# Altium project Learning stand.PrjPcb (part 2 of 2)

## Sheet LEDs.SchDoc
size 420 x 297 mm; Address1: Address1; Address2: Address2; Address3: Address3; Address4: Address4; DocumentNumber: МЭИ.466219.001 Э3; SheetNumber: 2; Scale: 1:1; DocumentType: Схема электрическая принципиальная; FirstReferrence: АБВГ.123456.001
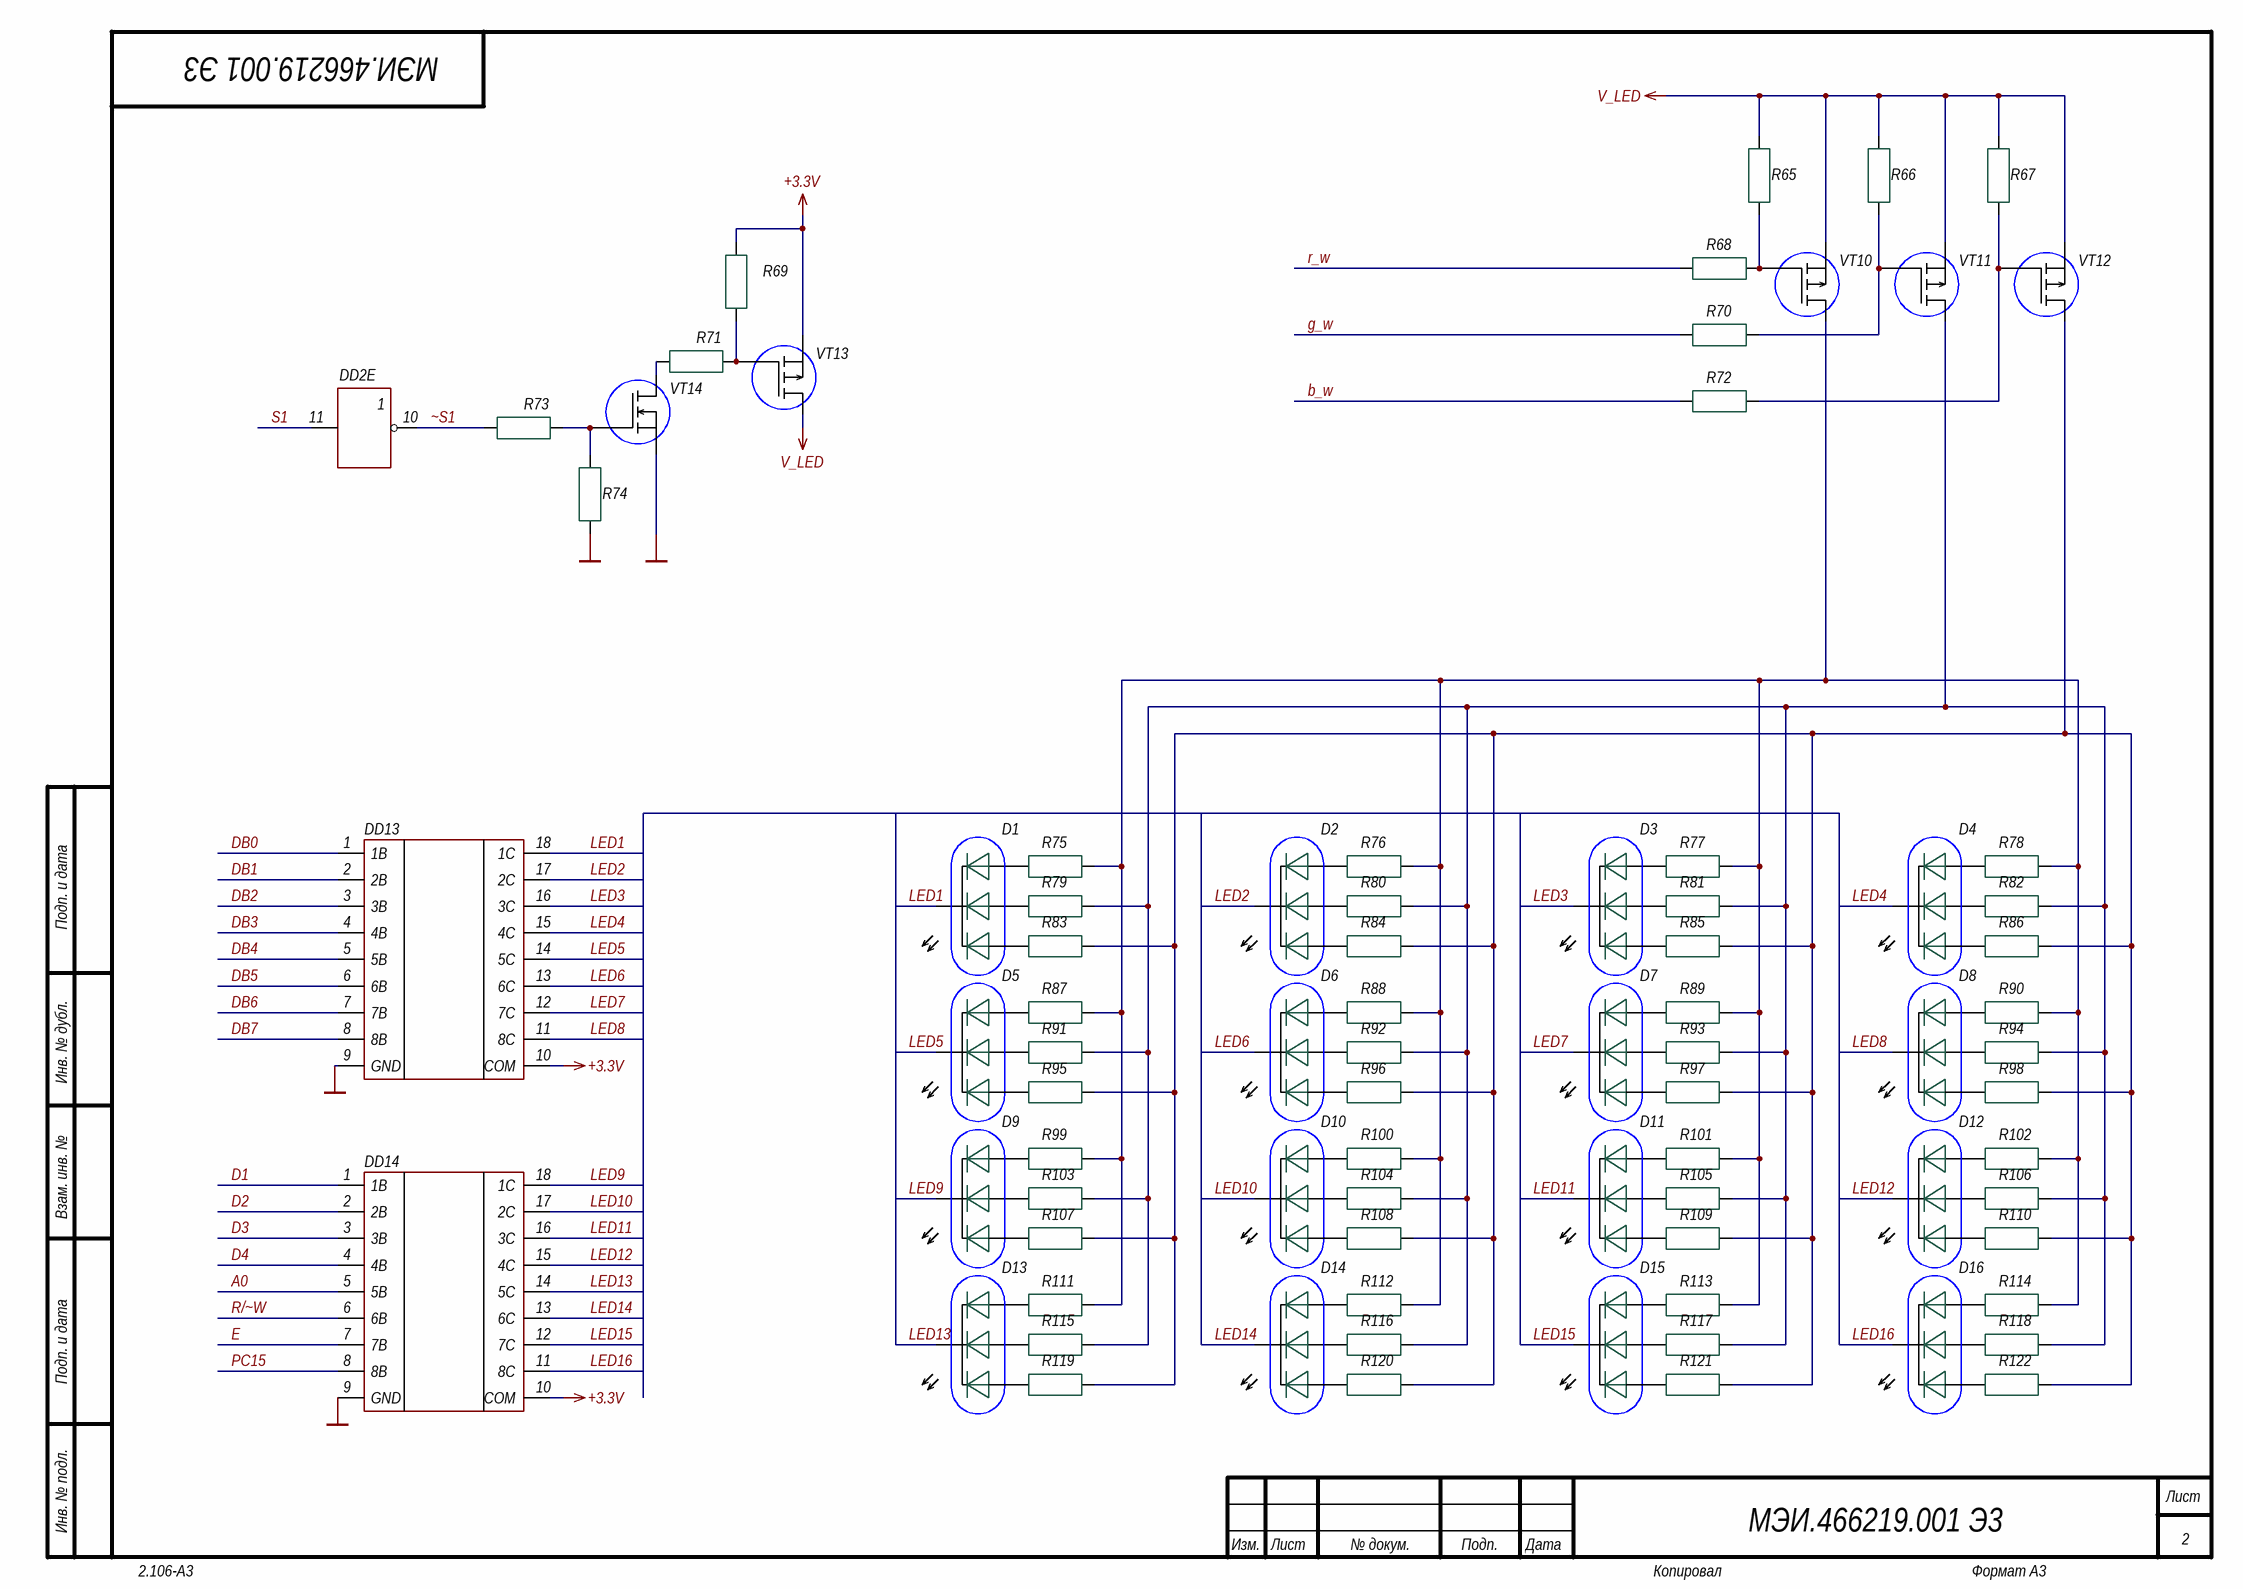
[diagram p4: LEDs.SchDoc]

### Parts
D1  FYLS-5050RGBC  [SOP6LED]  (value not drawn)
D2  FYLS-5050RGBC  [SOP6LED]  (value not drawn)
D3  FYLS-5050RGBC  [SOP6LED]  (value not drawn)
D4  FYLS-5050RGBC  [SOP6LED]  (value not drawn)
D5  FYLS-5050RGBC  [SOP6LED]  (value not drawn)
D6  FYLS-5050RGBC  [SOP6LED]  (value not drawn)
D7  FYLS-5050RGBC  [SOP6LED]  (value not drawn)
D8  FYLS-5050RGBC  [SOP6LED]  (value not drawn)
D9  FYLS-5050RGBC  [SOP6LED]  (value not drawn)
D10  FYLS-5050RGBC  [SOP6LED]  (value not drawn)
D11  FYLS-5050RGBC  [SOP6LED]  (value not drawn)
D12  FYLS-5050RGBC  [SOP6LED]  (value not drawn)
D13  FYLS-5050RGBC  [SOP6LED]  (value not drawn)
D14  FYLS-5050RGBC  [SOP6LED]  (value not drawn)
D15  FYLS-5050RGBC  [SOP6LED]  (value not drawn)
D16  FYLS-5050RGBC  [SOP6LED]  (value not drawn)
DD2  SN74AHCU04DR  [SOIC127P780X200-14N]  (value not drawn)  (part E of 7)
DD13  ULN2803ADW  [SOIC127P600-8N]  (value not drawn)
DD14  ULN2803ADW  [SOIC127P600-8N]  (value not drawn)
R65  Thick Film  [RESC1608X55N]  (value not drawn)
R66  Thick Film  [RESC1608X55N]  (value not drawn)
R67  Thick Film  [RESC1608X55N]  (value not drawn)
R68  Thick Film  [RESC1608X55N]  (value not drawn)
R69  Thick Film  [RESC1608X55N]  (value not drawn)
R70  Thick Film  [RESC1608X55N]  (value not drawn)
R71  Thick Film  [RESC1608X55N]  (value not drawn)
R72  Thick Film  [RESC1608X55N]  (value not drawn)
R73  Thick Film  [RESC1608X55N]  (value not drawn)
R74  Thick Film  [RESC1608X55N]  (value not drawn)
R75  Thick Film  [RESC1608X55N]  (value not drawn)
R76  Thick Film  [RESC1608X55N]  (value not drawn)
R77  Thick Film  [RESC1608X55N]  (value not drawn)
R78  Thick Film  [RESC1608X55N]  (value not drawn)
R79  Thick Film  [RESC1608X55N]  (value not drawn)
R80  Thick Film  [RESC1608X55N]  (value not drawn)
R81  Thick Film  [RESC1608X55N]  (value not drawn)
R82  Thick Film  [RESC1608X55N]  (value not drawn)
R83  Thick Film  [RESC1608X55N]  (value not drawn)
R84  Thick Film  [RESC1608X55N]  (value not drawn)
R85  Thick Film  [RESC1608X55N]  (value not drawn)
R86  Thick Film  [RESC1608X55N]  (value not drawn)
R87  Thick Film  [RESC1608X55N]  (value not drawn)
R88  Thick Film  [RESC1608X55N]  (value not drawn)
R89  Thick Film  [RESC1608X55N]  (value not drawn)
R90  Thick Film  [RESC1608X55N]  (value not drawn)
R91  Thick Film  [RESC1608X55N]  (value not drawn)
R92  Thick Film  [RESC1608X55N]  (value not drawn)
R93  Thick Film  [RESC1608X55N]  (value not drawn)
R94  Thick Film  [RESC1608X55N]  (value not drawn)
R95  Thick Film  [RESC1608X55N]  (value not drawn)
R96  Thick Film  [RESC1608X55N]  (value not drawn)
R97  Thick Film  [RESC1608X55N]  (value not drawn)
R98  Thick Film  [RESC1608X55N]  (value not drawn)
R99  Thick Film  [RESC1608X55N]  (value not drawn)
R100  Thick Film  [RESC1608X55N]  (value not drawn)
R101  Thick Film  [RESC1608X55N]  (value not drawn)
R102  Thick Film  [RESC1608X55N]  (value not drawn)
R103  Thick Film  [RESC1608X55N]  (value not drawn)
R104  Thick Film  [RESC1608X55N]  (value not drawn)
R105  Thick Film  [RESC1608X55N]  (value not drawn)
R106  Thick Film  [RESC1608X55N]  (value not drawn)
R107  Thick Film  [RESC1608X55N]  (value not drawn)
R108  Thick Film  [RESC1608X55N]  (value not drawn)
R109  Thick Film  [RESC1608X55N]  (value not drawn)
R110  Thick Film  [RESC1608X55N]  (value not drawn)
R111  Thick Film  [RESC1608X55N]  (value not drawn)
R112  Thick Film  [RESC1608X55N]  (value not drawn)
R113  Thick Film  [RESC1608X55N]  (value not drawn)
R114  Thick Film  [RESC1608X55N]  (value not drawn)
R115  Thick Film  [RESC1608X55N]  (value not drawn)
R116  Thick Film  [RESC1608X55N]  (value not drawn)
R117  Thick Film  [RESC1608X55N]  (value not drawn)
R118  Thick Film  [RESC1608X55N]  (value not drawn)
R119  Thick Film  [RESC1608X55N]  (value not drawn)
R120  Thick Film  [RESC1608X55N]  (value not drawn)
R121  Thick Film  [RESC1608X55N]  (value not drawn)
R122  Thick Film  [RESC1608X55N]  (value not drawn)
VT10  IRLML2244  [SOT23-3-no_check]  (value not drawn)
VT11  IRLML2244  [SOT23-3-no_check]  (value not drawn)
VT12  IRLML2244  [SOT23-3-no_check]  (value not drawn)
VT13  IRLML2244  [SOT23-3-no_check]  (value not drawn)
VT14  IRLML6244  [SOT23-3-no_check]  (value not drawn)

### Nets
+3.3V: DD13.10(COM) DD14.10(COM) R69.2 VT13.2(S)
GND: DD13.9(GND) DD14.9(GND) R74.1 VT14.2(S)
V_LED: R65.2 R66.2 R67.2 VT10.2(S) VT11.2(S) VT12.2(S) VT13.3(D)
A0: DD14.5(5B)
b_w: R72.1
D1: DD14.1(1B)
D2: DD14.2(2B)
D3: DD14.3(3B)
D4: DD14.4(4B)
DB0: DD13.1(1B)
DB1: DD13.2(2B)
DB2: DD13.3(3B)
DB3: DD13.4(4B)
DB4: DD13.5(5B)
DB5: DD13.6(6B)
DB6: DD13.7(7B)
DB7: DD13.8(8B)
E: DD14.7(7B)
g_w: R70.1
LED1: D1.K DD13.18(1C)
LED2: D2.K DD13.17(2C)
LED3: D3.K DD13.16(3C)
LED4: D4.K DD13.15(4C)
LED5: D5.K DD13.14(5C)
LED6: D6.K DD13.13(6C)
LED7: D7.K DD13.12(7C)
LED8: D8.K DD13.11(8C)
LED9: D9.K DD14.18(1C)
LED10: D10.K DD14.17(2C)
LED11: D11.K DD14.16(3C)
LED12: D12.K DD14.15(4C)
LED13: D13.K DD14.14(5C)
LED14: D14.K DD14.13(6C)
LED15: D15.K DD14.12(7C)
LED16: D16.K DD14.11(8C)
PC15: DD14.8(8B)
R/~W: DD14.6(6B)
r_w: R68.1
S1: DD2.11(5A)
~S1: DD2.10(5Y) R73.1
NetD1_AB: D1.AB R83.1
NetD1_AG: D1.AG R79.1
NetD1_AR: D1.AR R75.1
NetD2_AB: D2.AB R84.1
NetD2_AG: D2.AG R80.1
NetD2_AR: D2.AR R76.1
NetD3_AB: D3.AB R85.1
NetD3_AG: D3.AG R81.1
NetD3_AR: D3.AR R77.1
NetD4_AB: D4.AB R86.1
NetD4_AG: D4.AG R82.1
NetD4_AR: D4.AR R78.1
NetD5_AB: D5.AB R95.1
NetD5_AG: D5.AG R91.1
NetD5_AR: D5.AR R87.1
NetD6_AB: D6.AB R96.1
NetD6_AG: D6.AG R92.1
NetD6_AR: D6.AR R88.1
NetD7_AB: D7.AB R97.1
NetD7_AG: D7.AG R93.1
NetD7_AR: D7.AR R89.1
NetD8_AB: D8.AB R98.1
NetD8_AG: D8.AG R94.1
NetD8_AR: D8.AR R90.1
NetD9_AB: D9.AB R107.1
NetD9_AG: D9.AG R103.1
NetD9_AR: D9.AR R99.1
NetD10_AB: D10.AB R108.1
NetD10_AG: D10.AG R104.1
NetD10_AR: D10.AR R100.1
NetD11_AB: D11.AB R109.1
NetD11_AG: D11.AG R105.1
NetD11_AR: D11.AR R101.1
NetD12_AB: D12.AB R110.1
NetD12_AG: D12.AG R106.1
NetD12_AR: D12.AR R102.1
NetD13_AB: D13.AB R119.1
NetD13_AG: D13.AG R115.1
NetD13_AR: D13.AR R111.1
NetD14_AB: D14.AB R120.1
NetD14_AG: D14.AG R116.1
NetD14_AR: D14.AR R112.1
NetD15_AB: D15.AB R121.1
NetD15_AG: D15.AG R117.1
NetD15_AR: D15.AR R113.1
NetD16_AB: D16.AB R122.1
NetD16_AG: D16.AG R118.1
NetD16_AR: D16.AR R114.1
NetR65_1: R65.1 R68.2 VT10.1(G)
NetR66_1: R66.1 R70.2 VT11.1(G)
NetR67_1: R67.1 R72.2 VT12.1(G)
NetR69_1: R69.1 R71.2 VT13.1(G)
NetR71_1: R71.1 VT14.3(D)
NetR73_2: R73.2 R74.2 VT14.1(G)
NetR75_2: R75.2 R76.2 R77.2 R78.2 R87.2 R88.2 R89.2 R90.2 R99.2 R100.2 R101.2 R102.2 R111.2 R112.2 R113.2 R114.2 VT10.3(D)
NetR79_2: R79.2 R80.2 R81.2 R82.2 R91.2 R92.2 R93.2 R94.2 R103.2 R104.2 R105.2 R106.2 R115.2 R116.2 R117.2 R118.2 VT11.3(D)
NetR83_2: R83.2 R84.2 R85.2 R86.2 R95.2 R96.2 R97.2 R98.2 R107.2 R108.2 R109.2 R110.2 R119.2 R120.2 R121.2 R122.2 VT12.3(D)

### Notes on the sheet
- Подп. и дата
- Инв. № дубл.
- Взам. инв. №
- Инв. № подл.
- Изм.
- Лист
- № докум.
- Подп.
- Дата
- 2.106-A3
- Копировал
- Формат А3

### Library data of the parts
D1-D16 = FYLS-5050RGBC: RGB LED; Manufacture: FORYARD OPTOELECTRONICS CO.,LTD; Model: FYLS-5050RGBC; HelpURL: http://www.foryard.com/x-en/p-download/d-Part/u-f/m-1/n-f_FYLS-5050RGBC/y-394; Case: SMT package
DD2 = SN74AHCU04: HEX invertor; Manufacture: TI; HelpURL: https://www.compel.ru/infosheet/TI/SN74AHCU04D; Case: SO-14 (NS); Model: SN74AHCU04DR
DD13 DD14 = ULN2803: Darlington Assembly; Manufacture: TI; HelpURL: https://www.compel.ru/infosheet/TI/ULN2803ADWR; Case: SO-18; Model: ULN2803ADW
R65-R67 R69 R74 = RES_10K_0603_1%: Resistor SMD chip 10k Ohm 0.1W 1% 0603; Manufacturer 1: Yageo; Manufacturer Part Number 1: RC0603FR-0710KL; Ratings: 1/10W; SCDType: spec; ComponentLink1Designator: Compel; Package / Case: 0603 (1608 Metric); Supplier 1: Compel; Supplier Part Number 1: 311-10.0KHRCT-ND; Tolerance: ±1%; Value: 10K; ComponentLink1URL: https://www.compel.ru/infosheet/YAG/RC0603FR-0710KL
R68 R70-R73 = RES_470R_0603_5%: Resistor SMD chip 470 Ohm 0.1W 5% 0603; Manufacturer 1: Yageo; Manufacturer Part Number 1: CRCW0603470RJNEA; Ratings: 1/10 W; SCDType: spec; Value: 470R; ComponentLink1Designator: Compel; Package / Case: 0603 (1608 metric); Tolerance: ±5%; Material: Thick Film; Supplier 1: Compel; Supplier Part Number 1: 541-470GCT-ND; ComponentLink1URL: https://www.compel.ru/infosheet/YAG/RC0603FR-07470RL
R75-R122 = RES_1K2_0603_1%: Resistor SMD chip 1,2 kOhm 0.1W 1% 0603; Manufacturer 1: Yageo; Manufacturer Part Number 1: RC0603FR-071K2L; Ratings: 1/10 W; SCDType: spec; Value: 1,2k; ComponentLink1Designator: Compel; Package / Case: 0603 (1608 metric); Tolerance: ±1%; Material: Thick Film; Supplier 1: Compel; Supplier Part Number 1: 311-68GRCT-ND; ComponentLink1URL: https://www.compel.ru/infosheet/YAG/RC0603FR-0768RL
VT10-VT13 = MOSFET_P-CH_IRLML2244TRPbF: MOSFET P-Channel SMD; Manufacturer 1: Infineon; Ratings: 20V; 4.3A; SCDType: undef; Package / Case: SOT-23-3; Supplier 1: Compel; Supplier Part Number 1: IRLML2244TRPbF; ComponentLink1URL: https://www.compel.ru/item-pdf/b67edcdbc583bffdc43763720a97c5ae/ps/infin~irlml2246pbf.pdf; ComponentLink1Description: Data; ComponentLink2Description: Compel; ComponentLink2URL: https://www.compel.ru/infosheet/INFIN/IRLML2246TRPBF; Manufacturer Part Number 1: IRLML2244TRPbF
VT14 = MOSFET_N-CH_IRLML6244TRPBF: MOSFET N-Channel SMD; Manufacturer 1: Infineon; Ratings: 20V; 6.3A; SCDType: undef; Package / Case: SOT-23-3; Supplier 1: Compel; Supplier Part Number 1: IRLML6244TRPBF; ComponentLink1URL: https://www.compel.ru/item-pdf/c888608b045c7f9cf47a03db2a6506b1/ps/infin~irlml6244pbf.pdf; ComponentLink1Description: Data; ComponentLink2Description: Compel; ComponentLink2URL: https://www.compel.ru/infosheet/INFIN/IRLML6244TRPBF; Manufacturer Part Number 1: IRLML6244TRPBF

## Nets that join several sheets
+3.3V: Microcontroller (13 pins), Peripherals (22 pins), Communication (15 pins), Displays (6 pins), LEDs (DD13.10 DD14.10 R69.2 VT13.2)
AVCC: Microcontroller (A1.P2_19), Peripherals (DA2.1)
GND: Microcontroller (29 pins), Peripherals (34 pins), Communication (37 pins), Displays (8 pins), LEDs (DD13.9 DD14.9 R74.1 VT14.2)
A0: Microcontroller (A1.P2_13), Displays (HG1.4), LEDs (DD14.5)
ADC_IN0: Microcontroller (A1.P1_15), Communication (C24.1 R26.2 VD22.K)
ADC_IN1: Microcontroller (A1.P1_16), Communication (C26.1 R30.2 VD23.K)
b_w: Microcontroller (DD1.10), LEDs (R72.1)
C0: Microcontroller (A1.P2_10), Peripherals (R16.1)
C1: Microcontroller (A1.P2_9), Peripherals (R17.1)
C2: Microcontroller (A1.P2_8), Peripherals (R18.1)
C3: Microcontroller (A1.P2_7), Peripherals (R19.1)
CAN_RX: Microcontroller (A1.P2_4), Communication (DD12.4)
CAN_TX: Microcontroller (A1.P2_3), Communication (DD12.1)
D1: Microcontroller (A1.P2_27), Displays (DD2.1), LEDs (DD14.1)
D2: Microcontroller (A1.P2_26), Displays (DD2.3), LEDs (DD14.2)
D3: Microcontroller (A1.P2_15), Displays (DD2.5), LEDs (DD14.3)
D4: Microcontroller (A1.P2_14), Displays (DD2.9), LEDs (DD14.4)
DAC_OUT1: Microcontroller (A1.P1_21), Communication (R27.2)
DAC_OUT2: Microcontroller (A1.P1_22), Communication (R31.2)
DB0: Microcontroller (A1.P1_11), Displays (HG1.7), LEDs (DD13.1)
DB1: Microcontroller (A1.P1_12), Displays (HG1.8), LEDs (DD13.2)
DB2: Microcontroller (A1.P1_13), Displays (HG1.9), LEDs (DD13.3)
DB3: Microcontroller (A1.P1_14), Displays (HG1.10), LEDs (DD13.4)
DB4: Microcontroller (A1.P1_25), Displays (HG1.11), LEDs (DD13.5)
DB5: Microcontroller (A1.P1_26), Displays (HG1.12), LEDs (DD13.6)
DB6: Microcontroller (A1.P2_29), Displays (HG1.13), LEDs (DD13.7)
DB7: Microcontroller (A1.P2_28), Displays (HG1.14), LEDs (DD13.8)
E: Microcontroller (A1.P1_5), Displays (HG1.6), LEDs (DD14.7)
g_w: Microcontroller (DD1.4), LEDs (R70.1)
I2C_SCL: Microcontroller (A1.P1_30), Peripherals (DD6.6 DD7.2 DD8.6 R14.1)
I2C_SDA: Microcontroller (A1.P1_31), Peripherals (DD6.5 DD7.1 DD8.1 R15.1)
LCD: Microcontroller (DD3.3 R4.1), Displays (R55.1)
LED1: Displays (R57.1), LEDs (D1.K DD13.18)
LED2: Displays (R58.1), LEDs (D2.K DD13.17)
LED3: Displays (R59.1), LEDs (D3.K DD13.16)
LED4: Displays (R60.1), LEDs (D4.K DD13.15)
LED5: Displays (R61.1), LEDs (D5.K DD13.14)
LED6: Displays (R62.1), LEDs (D6.K DD13.13)
LED7: Displays (R63.1), LEDs (D7.K DD13.12)
LED8: Displays (R64.1), LEDs (D8.K DD13.11)
PC15: Microcontroller (A1.P1_6), LEDs (DD14.8)
R0: Microcontroller (A1.P1_27), Peripherals (VD6.A VD7.A VD8.A VD9.A)
R1: Microcontroller (A1.P1_28), Peripherals (VD10.A VD11.A VD12.A VD13.A)
R2: Microcontroller (A1.P1_29), Peripherals (VD14.A VD15.A VD16.A VD17.A)
R3: Microcontroller (A1.P2_11), Peripherals (VD18.A VD19.A VD20.A VD21.A)
R/~W: Microcontroller (A1.P1_4), Displays (HG1.5), LEDs (DD14.6)
r_w: Microcontroller (DD1.1), LEDs (R68.1)
S1: Microcontroller (DD1.11 DD3.1 DD3.5 S1.2), LEDs (DD2.11)
SevSeg: Microcontroller (DD3.7 R3.1), Displays (R40.1)
SPI_ADC: Microcontroller (A1.P2_16), Peripherals (DA2.5)
SPI_FLSH: Microcontroller (A1.P1_32), Peripherals (S5.2)
SPI_MISO: Microcontroller (A1.P2_31), Peripherals (DA2.6 DD5.8 R10.2 X5.7)
SPI_MOSI: Microcontroller (A1.P2_30), Peripherals (DD5.1 X5.3)
SPI_SCK: Microcontroller (A1.P2_32), Peripherals (DA2.7 DD5.2 X5.5)
SW1: Microcontroller (A1.P2_22), Peripherals (R8.1)
SW2: Microcontroller (A1.P2_21), Peripherals (R9.1)
SW3: Microcontroller (A1.P2_20), Peripherals (R11.1)
SW4: Microcontroller (A1.P2_17), Peripherals (R13.1)
USART2_RX: Microcontroller (A1.P1_18), Communication (DD9.1)
USART2_TX: Microcontroller (A1.P1_17), Communication (DD9.5)
XBEE_RX: Microcontroller (A1.P2_23), Communication (R32.1)
XBEE_TX: Microcontroller (A1.P2_24), Communication (R33.1)
XBRST: Microcontroller (A1.P2_12), Communication (A2.5 R34.1 X9.5)
~S1: Microcontroller (R2.1), LEDs (DD2.10 R73.1)

## Assembly variants
NotFitContrast: not fitted R64